# EAGLE design Design_Project (EAGLE 9.6.2)
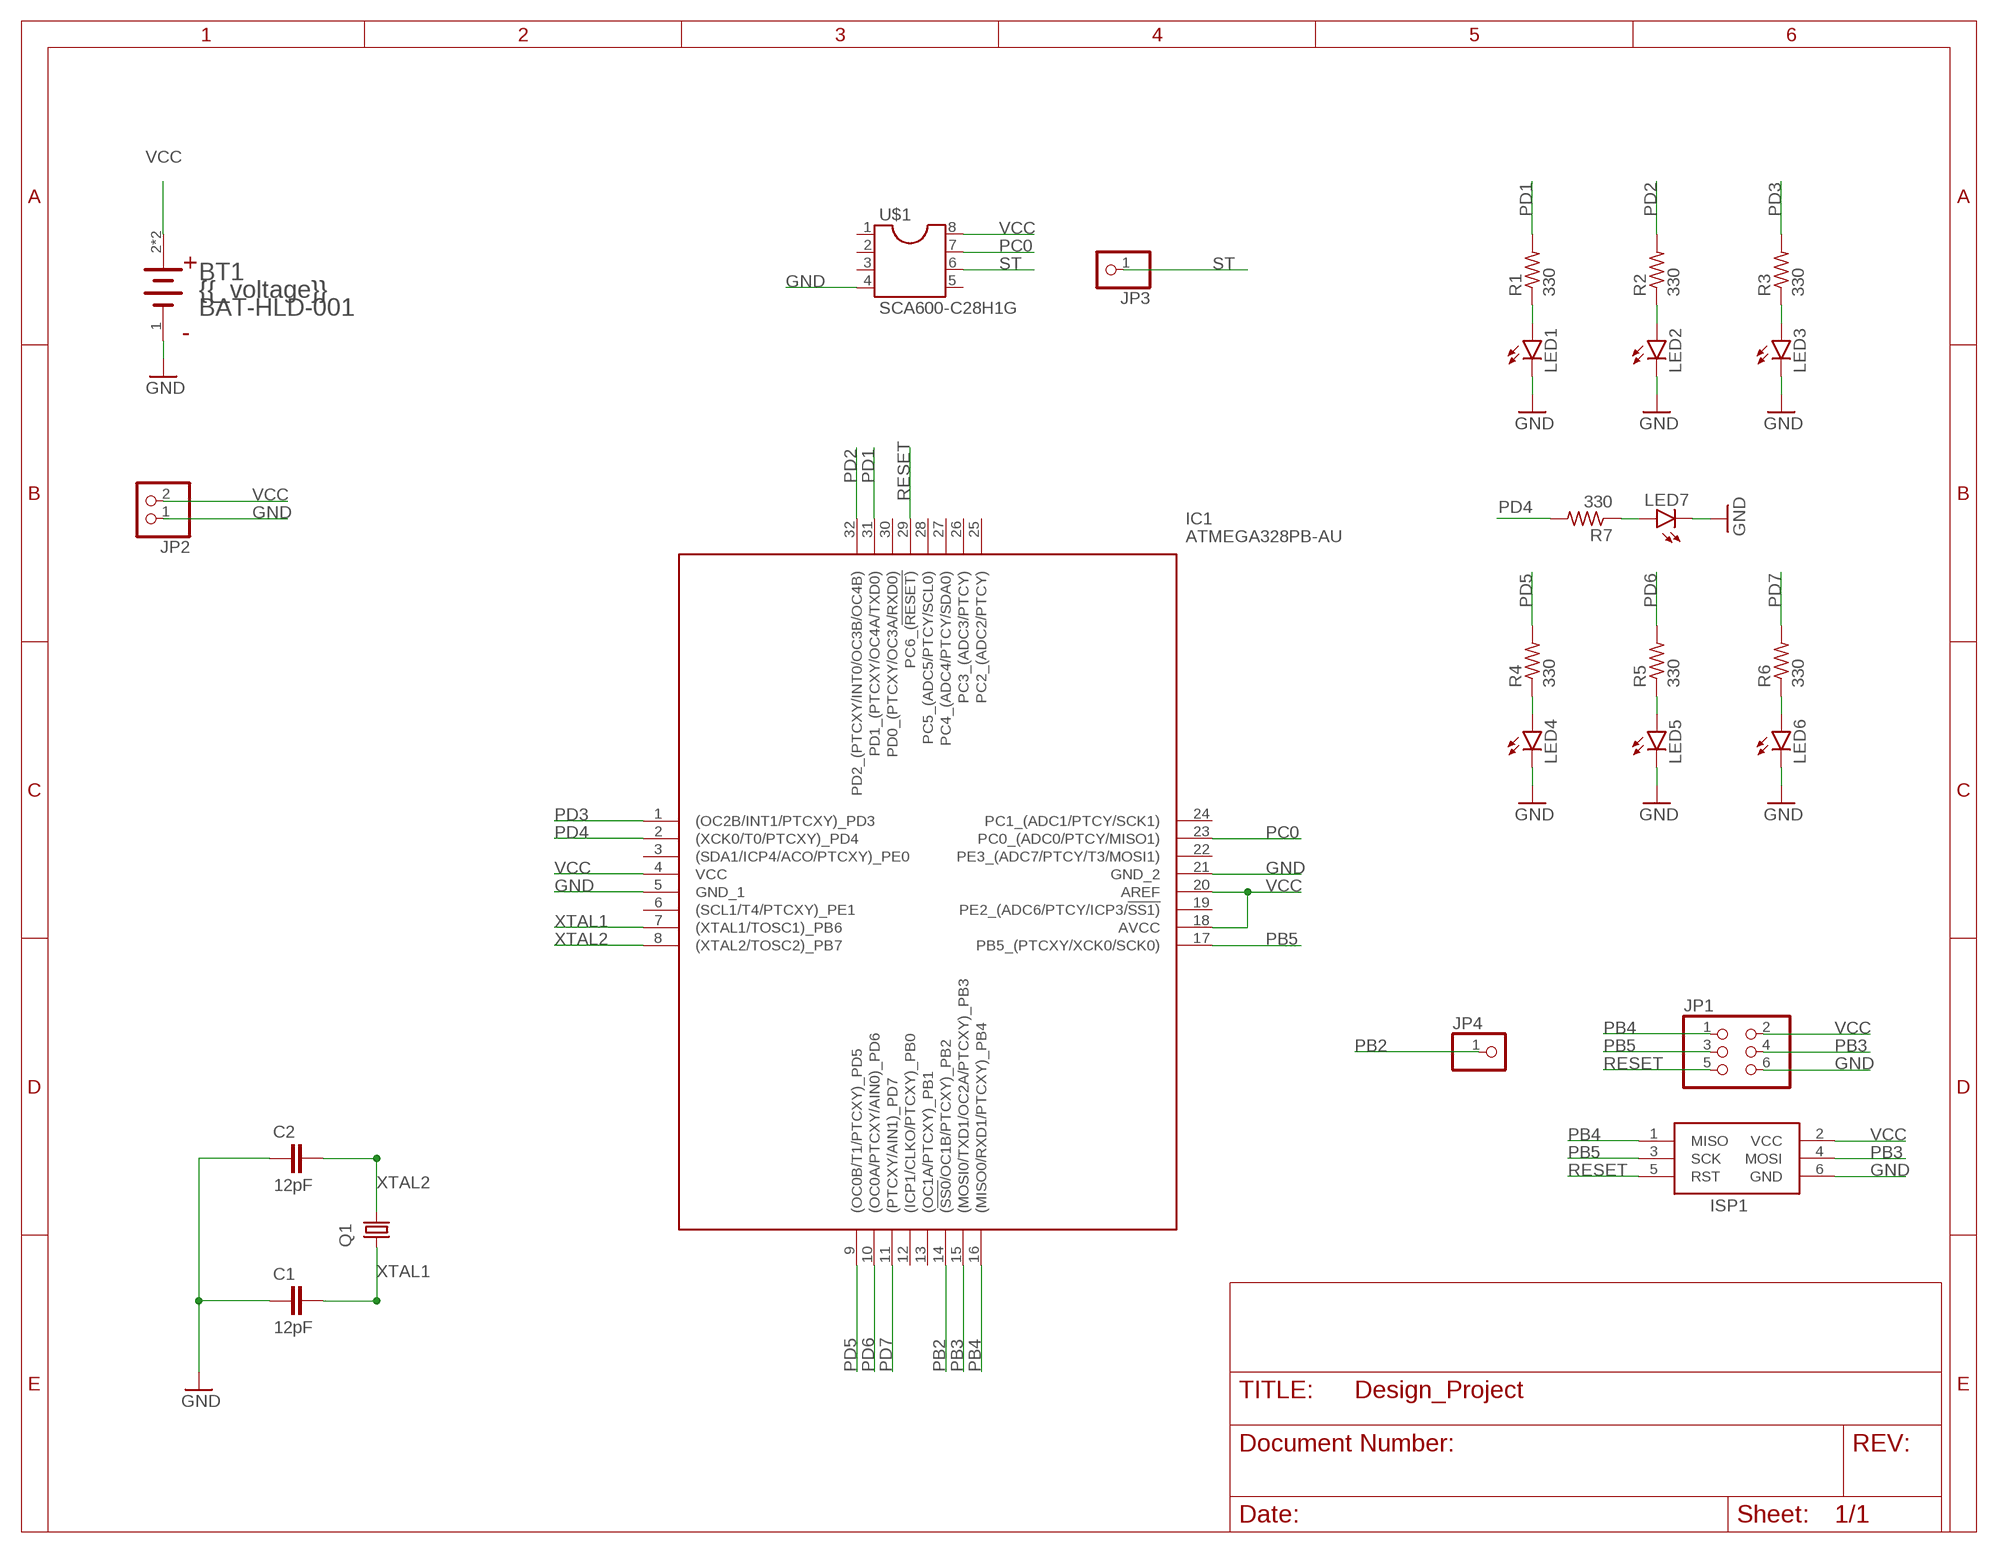
[diagram p0: schematic, sheet 1]

## Parts
BT1  LINX_BAT-HLD-001LINX_BAT-HLD-001_0_0  [LINX_BAT-HLD-001_0]
C1  12pF  C-EUC0805  [C0805]
C2  12pF  C-EUC0805  [C0805]
IC1  ATMEGA328PB-AU  [QFP80P900X900X120-32N]
ISP1  AVRISP-6  [AVRISP]
JP1  PINHD-2X3  [2X03]
JP2  PINHD-1X2  [1X02]
JP3  PINHD-1X1  [1X01]
JP4  PINHD-1X1  [1X01]
LED1  LEDCHIPLED_0805  [CHIPLED_0805]
LED2  LEDCHIPLED_0805  [CHIPLED_0805]
LED3  LEDCHIPLED_0805  [CHIPLED_0805]
LED4  LEDCHIPLED_0805  [CHIPLED_0805]
LED5  LEDCHIPLED_0805  [CHIPLED_0805]
LED6  LEDCHIPLED_0805  [CHIPLED_0805]
LED7  LEDCHIPLED_0805  [CHIPLED_0805]
Q1  CRYSTALHC49S  [HC49/S]
R1  330  R-US_M0805  [M0805]
R2  330  R-US_M0805  [M0805]
R3  330  R-US_M0805  [M0805]
R4  330  R-US_M0805  [M0805]
R5  330  R-US_M0805  [M0805]
R6  330  R-US_M0805  [M0805]
R7  330  R-US_M0805  [M0805]
U$1  SCA600-C28H1G  [SCA600-C28H1G]

## Nets
GND: BT1.1(CATHODE) C1.1 C2.1 IC1.5(GND_1) IC1.21(GND_2) ISP1.6(GND) JP1.6 JP2.1 LED1.C LED2.C LED3.C LED4.C LED5.C LED6.C LED7.C U$1.4
N$1: LED1.A R1.1
N$2: LED2.A R2.1
N$3: LED3.A R3.1
N$4: LED4.A R4.1
N$5: LED5.A R5.1
N$6: LED6.A R6.1
N$7: LED7.A R7.1
PB2: IC1.14((!SS0!/OC1B/PTCXY)_PB2) JP4.1
PB3: IC1.15((MOSI0/TXD1/OC2A/PTCXY)_PB3) ISP1.4(MOSI) JP1.4
PB4: IC1.16((MISO0/RXD1/PTCXY)_PB4) ISP1.1(MISO) JP1.1
PB5: IC1.17(PB5_(PTCXY/XCK0/SCK0)) ISP1.3(SCK) JP1.3
PC0: IC1.23(PC0_(ADC0/PTCY/MISO1)) U$1.7
PD1: IC1.31(PD1_(PTCXY/OC4A/TXD0)) R1.2
PD2: IC1.32(PD2_(PTCXY/INT0/OC3B/OC4B)) R2.2
PD3: IC1.1((OC2B/INT1/PTCXY)_PD3) R3.2
PD4: IC1.2((XCK0/T0/PTCXY)_PD4) R7.2
PD5: IC1.9((OC0B/T1/PTCXY)_PD5) R4.2
PD6: IC1.10((OC0A/PTCXY/AIN0)_PD6) R5.2
PD7: IC1.11((PTCXY/AIN1)_PD7) R6.2
RESET: IC1.29(PC6_(!RESET)) ISP1.5(RST) JP1.5
ST: JP3.1 U$1.6
VCC: BT1.2(ANODE) BT1.2-2(ANODE) IC1.4(VCC) IC1.18(AVCC) IC1.20(AREF) ISP1.2(VCC) JP1.2 JP2.2 U$1.8
XTAL1: C1.2 IC1.7((XTAL1/TOSC1)_PB6) Q1.1
XTAL2: C2.2 IC1.8((XTAL2/TOSC2)_PB7) Q1.2
Unconnected: IC1.3((SDA1/ICP4/ACO/PTCXY)_PE0) IC1.6((SCL1/T4/PTCXY)_PE1) IC1.12((ICP1/CLKO/PTCXY)_PB0) IC1.13((OC1A/PTCXY)_PB1) IC1.19(PE2_(ADC6/PTCY/ICP3/!SS1)) IC1.22(PE3_(ADC7/PTCY/T3/MOSI1)) IC1.24(PC1_(ADC1/PTCY/SCK1)) IC1.25(PC2_(ADC2/PTCY)) IC1.26(PC3_(ADC3/PTCY)) IC1.27(PC4_(ADC4/PTCY/SDA0)) IC1.28(PC5_(ADC5/PTCY/SCL0)) IC1.30(PD0_(PTCXY/OC3A/RXD0)) U$1.1 U$1.2 U$1.3 U$1.5

## Library data of the parts
BT1 = Linx - BAT-HLD-001:LINX_BAT-HLD-001: BATTERY HOLDER OUTLINE CR2032, CR2025 SURFACE MOUNT; CENTROID_NOT_SPECIFIED: No; DATASHEET: https://www.linxtechnologies.com/resources/diagrams/bat-hld-001.pdf; DIGIKEY_DESCRIPTION: BATT HOLDER BATTERY 20MM COIN; DIGIKEY_PART_NUMBER: BAT-HLD-001-ND; LEAD_FREE: yes; MF: Linx; MOUNTING_TYPE: Surface Mount; MOUSER_PART_NUMBER: 712-BAT-HLD-001; MPN: BAT-HLD-001; PACKAGE: BAT_SMT_21MM1_15MM5; PREFIX: BT; ROHS: yes
C1 C2 = rcl:C-EU: CAPACITOR, European symbol; SPICEPREFIX: C
IC1 = SamacSys_Parts:ATMEGA328PB-AU: ATMEL - ATMEGA328PB-AU - MCU, 8BIT, ATMEGA, 20MHZ, TQFP-32 Source: Datasheet <http://www.farnell.com/datasheets/2014286.pdf>; ARROW_PART_NUMBER: ATMEGA328PB-AU; ARROW_PRICE-STOCK: https://www.arrow.com/en/products/atmega328pb-au/microchip-technology; DESCRIPTION: ATMEL - ATMEGA328PB-AU - MCU, 8BIT, ATMEGA, 20MHZ, TQFP-32; HEIGHT: 1.2mm; MANUFACTURER_NAME: Microchip; MANUFACTURER_PART_NUMBER: ATMEGA328PB-AU; MOUSER_PART_NUMBER: 556-ATMEGA328PB-AU; MOUSER_PRICE-STOCK: https://www.mouser.co.uk/ProductDetail/Microchip-Technology-Atmel/ATMEGA328PB-AU?qs=jy4bLUHv09hbFONgGrqPbw%3D%3D
ISP1 = ECE388:AVRISP: AVR ISP HEADER Standard 6 pin header for AVR programming
JP1 = pinhead:PINHD-2X3: PIN HEADER
JP2 = pinhead:PINHD-1X2: PIN HEADER
JP3 JP4 = pinhead:PINHD-1X1: PIN HEADER
LED1-LED7 = led:LED: LED OSRAM: - CHIPLED LG R971, LG N971, LY N971, LG Q971, LY Q971, LO R971, LY R971 LH N974, LH R974 LS Q976, LO Q976, LY Q976 LO Q996 - Hyper CHIPLED LW Q18S LB Q993, LB Q99A, LB R99A - SideLED LS A670, LO A670, LY A670, LG A670, LP A670 LB A673, LV A673, LT A673, LW A673 LH A674 LY A675 LS A676, LA A676, LO A676, LY A676, LW A676 LS A679, LY A679, LG A679 - Hyper Micro SIDELED® LS Y876, LA Y876, LO Y876, LY Y876 LT Y87S - SmartLED LW L88C, LW L88S LB L89C, LB L89S, LG L890 LS L89K, LO L89K, LY L89K LS L896, LA L896, LO L896, LY L896 - TOPLED LS T670, LO T670, LY T670, LG T670, LP T670 LSG T670, LSP T670, LSY T670, LOP T670, LYG T670 LG T671, LOG T671, LSG T671 LB T673, LV T673, LT T673, LW T673 LH T674 LS T676, LA T676, LO T676, LY T676, LB T676, LH T676, LSB T676, LW T676 LB T67C, LV T67C, LT T67C, LS T67K, LO T67K, LY T67K, LW E67C LS E67B, LA E67B, LO E67B, LY E67B, LB E67C, LV E67C, LT E67C LW T67C LS T679, LY T679, LG T679 LS T770, LO T770, LY T770, LG T770, LP T770 LB T773, LV T773, LT T773, LW T773 LH T774 LS E675, LA E675, LY E675, LS T675 LS T776, LA T776, LO T776, LY T776, LB T776 LHGB T686 LT T68C, LB T68C - Hyper Mini TOPLED® LB M676 - Mini TOPLED Santana® LG M470 LS M47K, LO M47K, LY M47K Source: http://www.osram.convergy.de LUXEON: - LUMILED® LXK2-PW12-R00, LXK2-PW12-S00, LXK2-PW14-U00, LXK2-PW14-V00 LXK2-PM12-R00, LXK2-PM12-S00, LXK2-PM14-U00 LXK2-PE12-Q00, LXK2-PE12-R00, LXK2-PE12-S00, LXK2-PE14-T00, LXK2-PE14-U00 LXK2-PB12-K00, LXK2-PB12-L00, LXK2-PB12-M00, LXK2-PB14-N00, LXK2-PB14-P00, LXK2-PB14-Q00 LXK2-PR12-L00, LXK2-PR12-M00, LXK2-PR14-Q00, LXK2-PR14-R00 LXK2-PD12-Q00, LXK2-PD12-R00, LXK2-PD12-S00 LXK2-PH12-R00, LXK2-PH12-S00 LXK2-PL12-P00, LXK2-PL12-Q00, LXK2-PL12-R00 Source: www.luxeon.com KINGBRIGHT: KA-3528ASYC Source: www.kingbright.com
Q1 = crystal:CRYSTAL: CRYSTAL; OC_FARNELL: 1667008; OC_NEWARK: unknown
R1-R7 = rcl:R-US_: RESISTOR, American symbol; SPICEPREFIX: R
U$1 = SCA600-C28H1G:SCA600-C28H1G

## Board
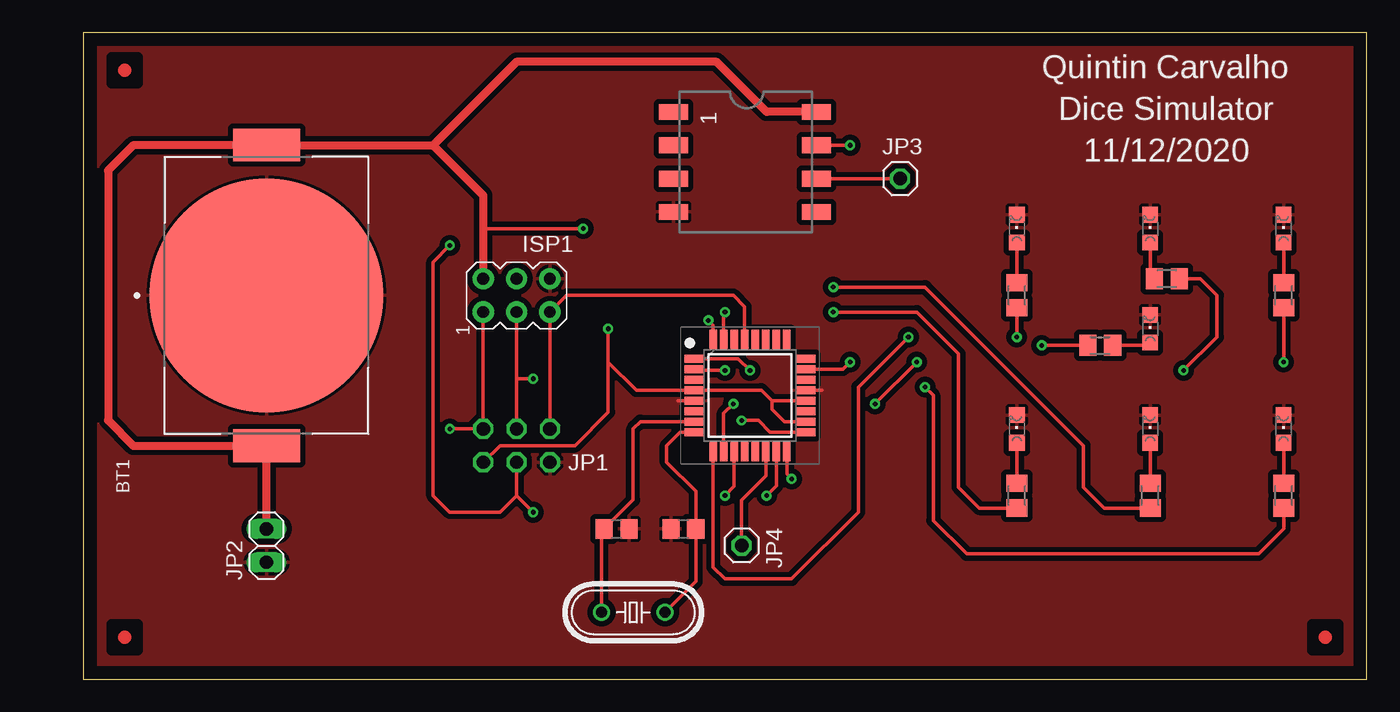
[diagram p1: board, top side]
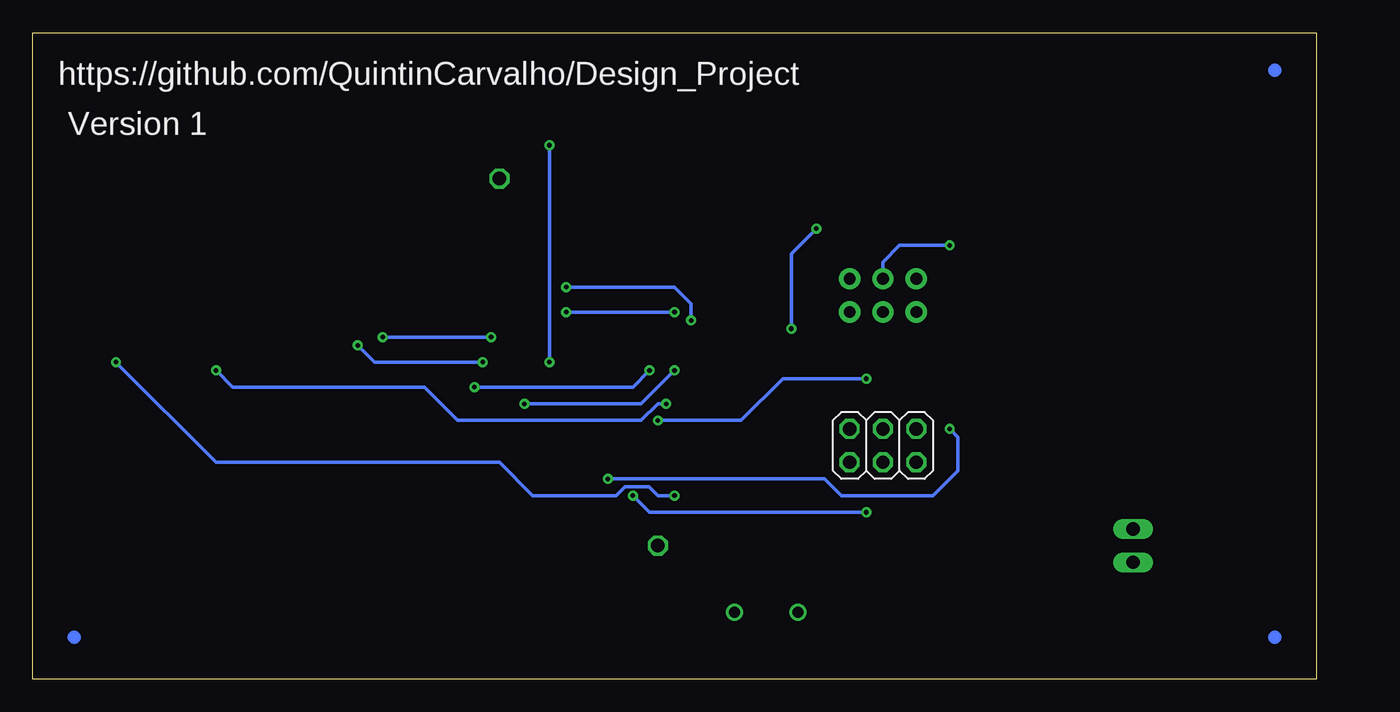
[diagram p2: board, bottom side, seen from below]

Size 97.77 x 49.2 mm. Coordinates in mm from the lower left corner, seen from the top.
Outline: 0,0 97.77,0 97.77,49.2 0,49.2 0,0
Copper layers (1*16): Top 0.035mm / dielectric 1.5mm / Bottom 0.035mm
Design rules "Design_Project": minimum track width 6mil, minimum drill 0.35mm, track to track 6mil, track to pad 6mil, pad to pad 6mil, via to via 6mil, smd to smd 6mil, copper to edge 40mil, drill to drill 6mil, minimum pad ring 10mil, minimum via ring 8mil, stop-mask expansion 4mil, vias tented up to drill 0mil, thermal gap 10mil

### Footprints (pad centres in the part's own frame; a part is rotated, then mirrored left to right if it is on the bottom)
LINX_BAT-HLD-001_0 = smd 17.8 x 17.8: 1 0,0 | smd 2.5 x 5.1: 2 -11.45,0; 2-2 11.45,0
C0805 = smd 1.3 x 1.5: 1 -0.95,0; 2 0.95,0
QFP80P900X900X120-32N = smd 1.5 x 0.6: 1 -4.25,2.8; 2 -4.25,2; 3 -4.25,1.2; 4 -4.25,0.4; 5 -4.25,-0.4; 6 -4.25,-1.2; 7 -4.25,-2; 8 -4.25,-2.8; 17 4.25,-2.8; 18 4.25,-2; 19 4.25,-1.2; 20 4.25,-0.4; 21 4.25,0.4; 22 4.25,1.2; 23 4.25,2; 24 4.25,2.8 | smd 0.6 x 1.5: 9 -2.8,-4.25; 10 -2,-4.25; 11 -1.2,-4.25; 12 -0.4,-4.25; 13 0.4,-4.25; 14 1.2,-4.25; 15 2,-4.25; 16 2.8,-4.25; 25 2.8,4.25; 26 2,4.25; 27 1.2,4.25; 28 0.4,4.25; 29 -0.4,4.25; 30 -1.2,4.25; 31 -2,4.25; 32 -2.8,4.25
AVRISP = drill 0.9 pad 1.626: 1 -1.27,2.54; 2 1.27,2.54; 3 -1.27,0; 4 1.27,0; 5 -1.27,-2.54; 6 1.27,-2.54
2X03 = drill 1.016 octagon: 1 -2.54,-1.27; 2 -2.54,1.27; 3 0,-1.27; 4 0,1.27; 5 2.54,-1.27; 6 2.54,1.27
1X02 = drill 1.016 long: 1 -1.27,0; 2 1.27,0
1X01 = drill 1.016 octagon: 1 0,0
CHIPLED_0805 = smd 1.2 x 1.2: A 0,-1.05; C 0,1.05
HC49/S = drill 0.813: 1 -2.413,0; 2 2.413,0
M0805 = smd 1.3 x 1.6: 1 -0.95,0; 2 0.95,0
SCA600-C28H1G = smd 1.2 x 2.2: 1 -3.81,-7.102; 2 -1.27,-7.102; 3 1.27,-7.102; 4 3.81,-7.102; 5 3.81,3.8; 6 1.27,3.8; 7 -1.27,3.8; 8 -3.81,3.8

### Placement (x,y rotation side)
BT1  13.97,29.21 90 top
C1  40.64,11.43 180 top
C2  45.72,11.43 0 top
IC1  50.8,21.59 0 top
ISP1  33.02,29.21 90 top
JP1  33.02,17.78 180 bottom
JP2  13.97,10.16 90 top
JP3  62.23,38.1 0 top
JP4  50.16,10.16 270 top
LED1  71.12,19.05 0 top
LED2  81.28,19.05 0 top
LED3  91.44,19.05 0 top
LED4  71.12,34.29 0 top
LED5  81.28,34.29 0 top
LED6  91.44,34.29 0 top
LED7  81.28,26.67 0 top
Q1  41.91,5.08 0 top
R1  71.12,13.97 270 top
R2  81.28,13.97 270 top
R3  91.44,13.97 270 top
R4  71.12,29.21 270 top
R5  82.55,30.48 0 top
R6  91.44,29.21 270 top
R7  77.47,25.4 180 top
U$1  52.07,39.37 270 top
U$2  [FID-ROUND-1MM]  3.17,46.35 0 top
U$3  [FID-ROUND-1MM]  3.17,3.17 0 top
U$4  [FID-ROUND-1MM]  94.61,3.17 0 top

### Tracks (layer width: path | path; a pad name or v marks a point on that pad's centre or on a via)
GND
  Top 0.254: IC1.21 56.28,21.99 | IC1.5 45.32,21.19
  pour Top (isolate 0.406): 0.64,48.9 0.64,0.64 97.16,0.64 97.16,48.9
N$1
  Top 0.254: LED1.A R1.1
N$2
  Top 0.254: R2.1 LED2.A
N$3
  Top 0.254: LED3.A R3.1
N$4
  Top 0.254: R4.1 LED4.A
N$5
  Top 0.254: R5.1 81.28,30.8 LED5.A
N$6
  Top 0.254: LED6.A R6.1
N$7
  Top 0.254: R7.1 81.06,25.4 LED7.A
PB2
  Top 0.254: IC1.14 52,15.46 50.14,13.61 50.14,10.77 50.16,10.75 JP4.1
PB3  (via drill 0.35)
  Top 0.254: JP1.4 33.02,13.97 | 33.02,13.97 31.75,12.7 27.94,12.7 26.67,13.97 26.67,31.75 v27.94,33.02 | 33.02,13.97 v34.29,12.7 | IC1.15 52.8,14.7 v52.07,13.97
  Bottom 0.254: v27.94,33.02 31.75,33.02 33.02,31.75 ISP1.4 | v34.29,12.7 50.8,12.7 v52.07,13.97
PB4  (via drill 0.35)
  Top 0.254: ISP1.1 JP1.1 v27.94,19.05 | IC1.16 53.6,15.62 v53.98,15.24
  Bottom 0.254: v53.98,15.24 37.47,15.24 36.2,13.97 29.21,13.97 27.3,15.88 27.3,18.41 v27.94,19.05
PB5  (via drill 0.35)
  Top 0.254: ISP1.3 33.02,22.86 | 33.02,22.86 JP1.3 | 33.02,22.86 v34.29,22.86 | v50.16,19.68 51.44,19.68 52.33,18.79 IC1.17
  Bottom 0.254: v34.29,22.86 40.64,22.86 43.81,19.68 v50.16,19.68
PC0  (via drill 0.35)
  Top 0.254: U$1.7 v58.42,40.64 | v58.42,24.13 57.88,23.59 IC1.23
  Bottom 0.254: v58.42,40.64 v58.42,24.13
PD1  (via drill 0.35)
  Top 0.254: IC1.31 48.8,27.84 v48.9,27.94 | v57.15,27.94 63.5,27.94 66.67,24.77 66.67,14.61 68.26,13.02 R1.2
  Bottom 0.254: v48.9,27.94 v57.15,27.94
PD2  (via drill 0.35)
  Top 0.254: IC1.32 48,26.93 v47.62,27.3 | R2.2 77.78,13.02 76.2,14.61 76.2,17.78 64.14,29.84 v57.15,29.84
  Bottom 0.254: v47.62,27.3 47.62,28.57 48.9,29.84 v57.15,29.84
PD3  (via drill 0.35)
  Top 0.254: IC1.1 49.91,24.39 v50.8,23.5 | v64.14,22.23 64.77,21.59 64.77,12.06 67.31,9.53 89.53,9.53 91.44,11.43 R3.2
  Bottom 0.254: v50.8,23.5 52.07,22.23 v64.14,22.23
PD4  (via drill 0.35)
  Top 0.254: IC1.2 46.65,23.5 v48.9,23.5 | v60.33,20.95 v63.5,24.13 | v73.03,25.4 R7.2
  Bottom 0.254: v48.9,23.5 51.44,20.95 v60.33,20.95 | v63.5,24.13 71.75,24.13 v73.03,25.4
PD5  (via drill 0.35)
  Top 0.254: IC1.9 48,8.52 48.9,7.62 53.98,7.62 59.05,12.7 59.05,22.23 v62.87,26.04 | v71.12,26.04 R4.2
  Bottom 0.254: v62.87,26.04 v71.12,26.04
PD6  (via drill 0.35)
  Top 0.254: IC1.10 48.8,20.23 v49.53,20.95 | v83.82,23.5 86.36,26.04 86.36,29.21 85.09,30.48 R5.2
  Bottom 0.254: v49.53,20.95 50.16,20.95 51.44,19.68 65.41,19.68 67.94,22.23 82.55,22.23 v83.82,23.5
PD7  (via drill 0.35)
  Top 0.254: IC1.11 49.6,14.68 v48.9,13.97 | v91.44,24.13 R6.2
  Bottom 0.254: v48.9,13.97 50.16,13.97 50.82,14.63 52.68,14.63 53.34,13.97 59.69,13.97 62.23,16.51 83.82,16.51 v91.44,24.13
RESET
  Top 0.254: JP1.5 ISP1.5 36.83,29.21 49.53,29.21 50.4,28.34 IC1.29
ST
  Top 0.254: U$1.6 JP3.1
VCC  (via drill 0.35)
  Top 0.254: 40.01,24.13 42.15,21.99 IC1.4 51.67,21.99 52.47,21.19 | 40.01,24.13 v40.01,26.67 | v38.1,34.29 30.48,34.29 | 52.47,21.19 IC1.20 | IC1.18 53.44,19.59 52.47,20.55 52.47,21.19 | JP1.2 31.75,17.78 37.47,17.78 40.01,20.32 40.01,24.13
  Top 0.61: JP2.2 BT1.2 3.83,17.76 1.91,19.68 1.91,38.73 3.81,40.64 13.95,40.64 BT1.2-2 26.65,40.66 26.67,40.64 | 26.67,40.64 30.48,36.83 30.48,34.29 ISP1.2 | U$1.8 52.07,43.18 48.26,46.99 33.02,46.99 26.67,40.64
  Bottom 0.254: v40.01,26.67 40.01,32.38 v38.1,34.29
XTAL1
  Top 0.254: Q1.1 39.5,11.24 C1.2 41.91,13.65 41.91,19.05 42.45,19.59 IC1.7
XTAL2
  Top 0.254: Q1.2 46.67,7.43 C2.2 46.67,14.29 44.45,16.51 44.45,17.78 45.46,18.79 IC1.8

### Text on the board
tNames: Quintin Carvalho | Dice Simulator | 11/12/2020
bNames: https://github.com/QuintinCarvalho/Design_Project | Version 1